# EAGLE board InkTime (EAGLE 9.7.0)
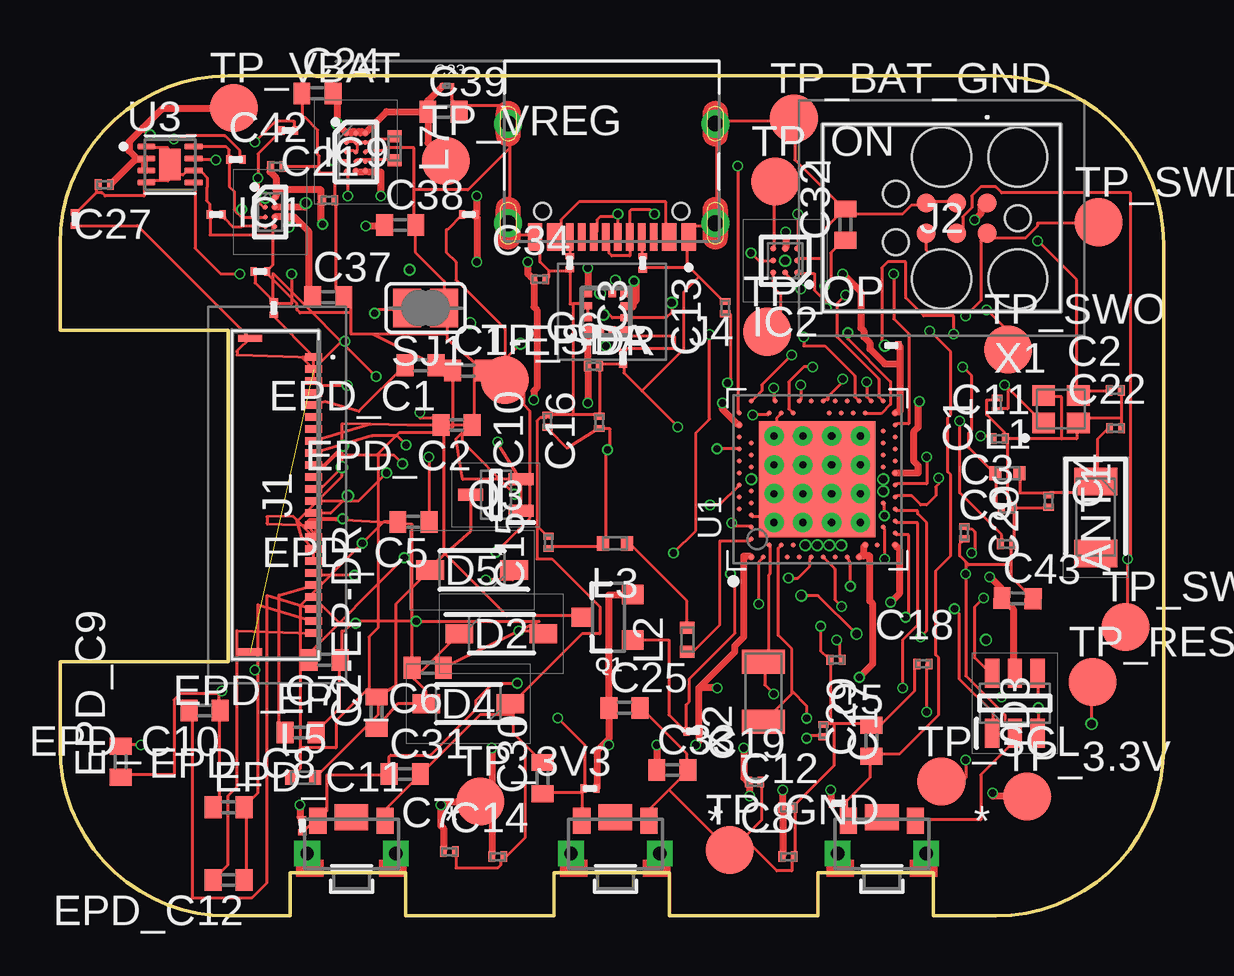
[diagram p2: board, top side]
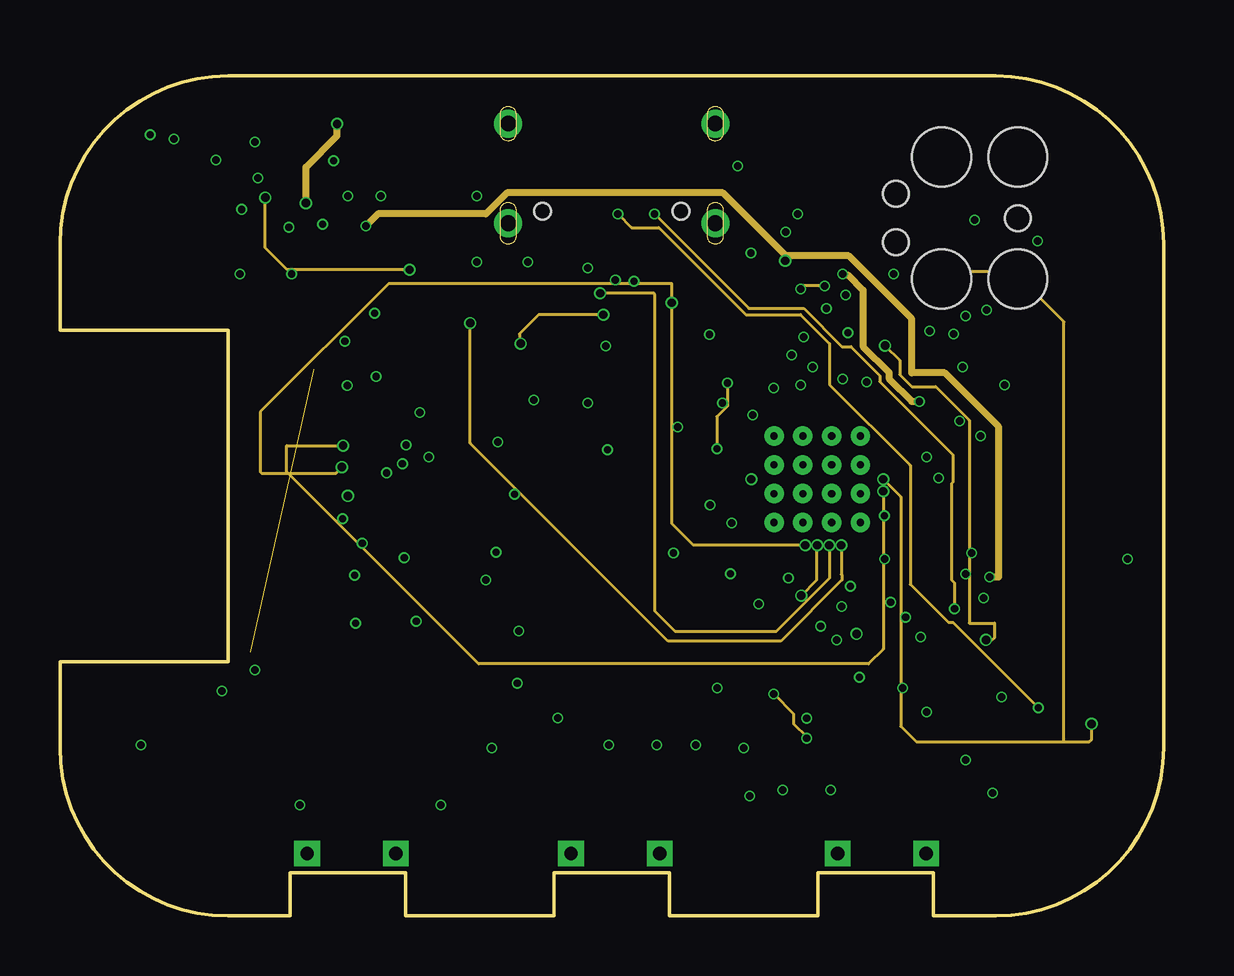
[diagram p3: board, inner layer Route2]
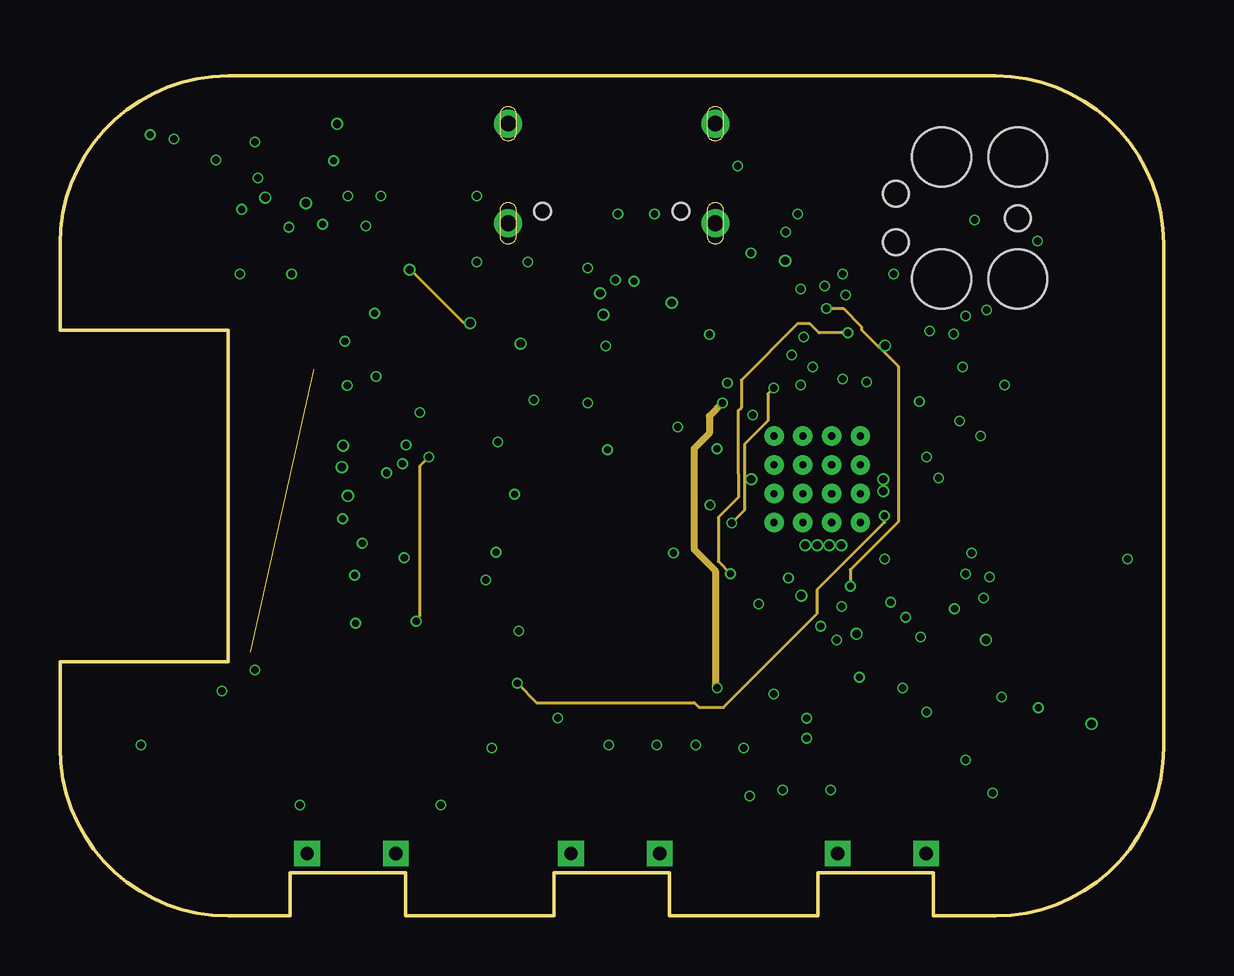
[diagram p4: board, inner layer Route15]
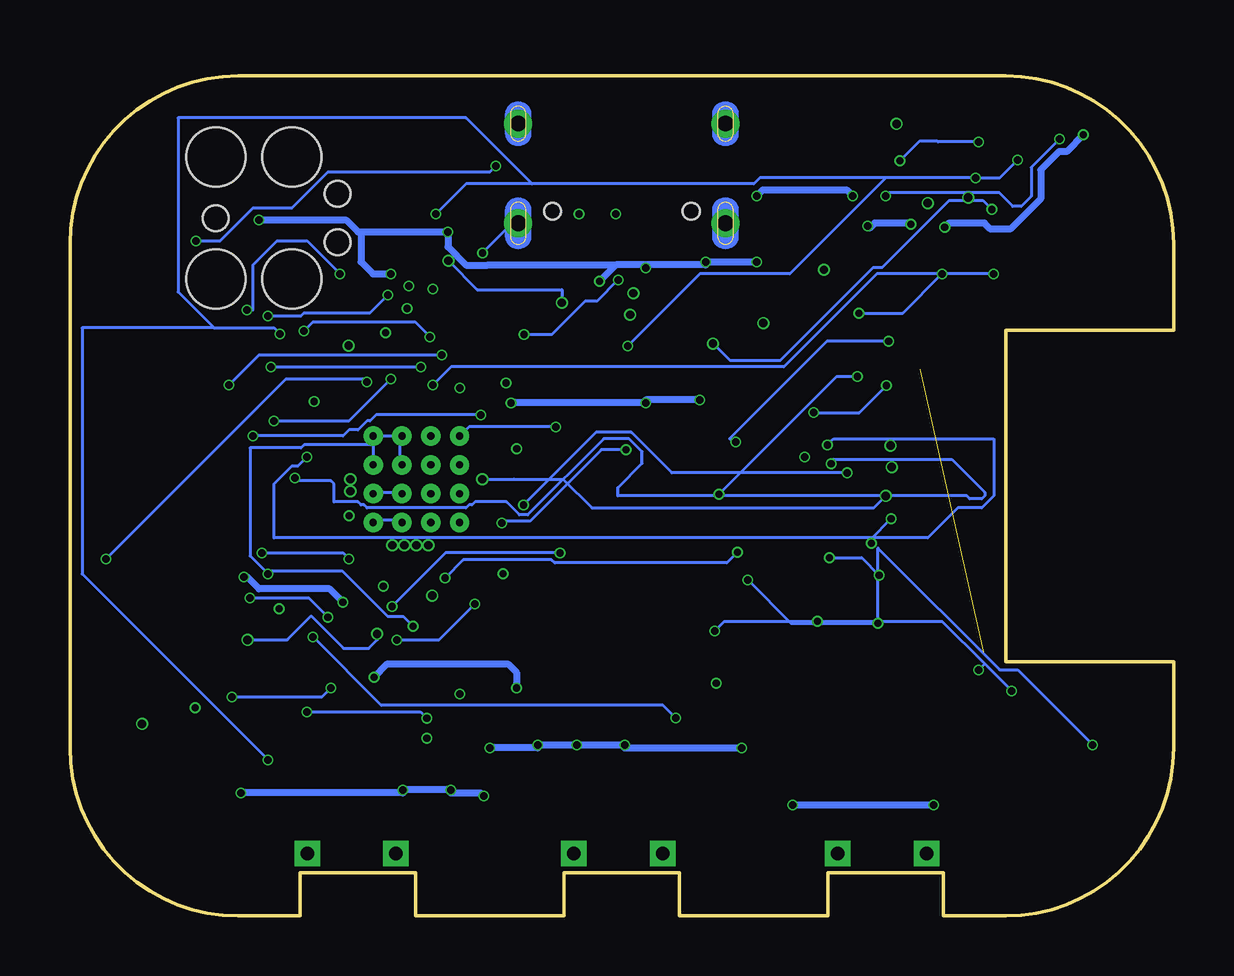
[diagram p5: board, bottom side, seen from below]

Size 46 x 35 mm. Coordinates in mm from the lower left corner, seen from the top.
Outline: 7,35 39,35 arc-90 46,28 46,7 arc-90 39,0 36.4,0 36.4,1.8 31.6,1.8 31.6,0 25.4,0 25.4,1.8 20.6,1.8 20.6,0 14.4,0 14.4,1.8 9.6,1.8 9.6,0 7,0 arc-90 0,7 0,10.6 7,10.6 7,24.4 0,24.4 0,28 arc-90 7,35
Copper layers (1+2*15+16): Top 0.035mm / dielectric 1.6mm / Route2 0.035mm / dielectric 0.15mm / Route15 0.035mm / dielectric 0.2mm / Bottom 0.035mm
Design rules "jlcpcb-2layers.dru *": minimum track width 5mil, minimum drill 0.3mm, track to track 5mil, track to pad 5mil, pad to pad 5mil, via to via 5mil, smd to smd 5mil, copper to edge 0.2mm, drill to drill 6mil, minimum pad ring 10mil, minimum via ring 3mil, stop-mask expansion 4mil, vias tented up to drill 0mil, thermal gap 10mil
Net classes: 1 trasee-de-alimentare: width 0.3 mm

## Footprints (pad centres in the part's own frame; a part is rotated, then mirrored left to right if it is on the bottom)
2450AT18B100E_ANTC3216X140N = smd 1.15 x 1.8: 1 -1.5,0; 2 1.5,0
NORDIC_NRF_3_RESC0201_L = smd 0.28 x 0.43: 1 -0.255,0; 2 0.255,0
ESP32_C6_LIBRARY_1_ESP32_WROVER_EAGLE-LTSPICE_C0402 = smd 0.7 x 0.9: 1 -0.65,0; 2 0.65,0
GRM011R60J152KE01L_2_CAPC0201X13N = smd 0.22 x 0.23: 1 -0.185,0; 2 0.185,0
ESP32_C6_LIBRARY_5_SOD3716X135N = smd 1.15 x 0.8: 1 -1.75,0; 2 1.75,0
ESP32_C6_LIBRARY_3_SOT95P280X145-6N = smd 1.2 x 0.6: 1 -1.25,0.95; 2 -1.25,0; 3 -1.25,-0.95; 4 1.25,-0.95; 5 1.25,0; 6 1.25,0.95
BQ25180YBGR_BGA8C40P2X4_100X155X50 = smd 0.2 x 0.2: A1 -0.2,0.6; A2 0.2,0.6; B1 -0.2,0.2; B2 0.2,0.2; C1 -0.2,-0.2; C2 0.2,-0.2; D1 -0.2,-0.6; D2 0.2,-0.6
DRV2605YZFR_BGA9C50P3X3_144X144X62 = smd 0.25 x 0.25: A1 -0.5,0.5; A2 0,0.5; A3 0.5,0.5; B1 -0.5,0; B2 0,0; B3 0.5,0; C1 -0.5,-0.5; C2 0,-0.5; C3 0.5,-0.5
BMA423_BMA423 = smd 0.3 x 0.35: 1 -0.75,-0.775; 2 -0.25,-0.775; 3 0.25,-0.775; 4 0.75,-0.775; 7 0.75,0.775; 8 0.25,0.775; 9 -0.25,0.775; 10 -0.75,0.775 | smd 0.35 x 0.3: 5 0.775,-0.25; 6 0.775,0.25; 11 -0.775,0.25; 12 -0.775,-0.25
RT6160AWSC_BGA15C40P3X5_140X230X60 = smd 0.216 x 0.216: A1 -0.4,0.8; A2 0,0.8; A3 0.4,0.8; B1 -0.4,0.4; B2 0,0.4; B3 0.4,0.4; C1 -0.4,0; C2 0,0; C3 0.4,0; D1 -0.4,-0.4; D2 0,-0.4; D3 0.4,-0.4; E1 -0.4,-0.8; E2 0,-0.8; E3 0.4,-0.8
503480-2400_5034802400 = smd 0.3 x 0.7: 1 -5.75,1.525; 2 -5.25,1.525; 3 -4.75,1.525; 4 -4.25,1.525; 5 -3.75,1.525; 6 -3.25,1.525; 7 -2.75,1.525; 8 -2.25,1.525; 9 -1.75,1.525; 10 -1.25,1.525; 11 -0.75,1.525; 12 -0.25,1.525; 13 0.25,1.525; 14 0.75,1.525; 15 1.25,1.525; 16 1.75,1.525; 17 2.25,1.525; 18 2.75,1.525; 19 3.25,1.525; 20 3.75,1.525; 21 4.25,1.525; 22 4.75,1.525; 23 5.25,1.525; 24 5.75,1.525 | smd 0.3 x 1: MP1 -6.54,-1.125; MP2 6.54,-1.125
TC2030-IDC_TC2030IDC = smd 0.783 x 0.783: 1 -0.953,-0.635; 2 -0.953,0.635; 3 0.317,-0.635; 4 0.317,0.635; 5 1.588,-0.635; 6 1.588,0.635 | hole 2.451: -2.223,-2.54; -2.223,2.54; 0.952,-2.54; 0.952,2.54 | hole 1.067: -2.223,0; 2.857,-1.016; 2.857,1.016
KH-TYPE-C-16P_KINGHELM_KH-TYPE-C-16P = smd 0.6 x 1.15: A1_B12 -3.2,4.725; A4_B9 -2.4,4.725; A9_B4 2.4,4.725; A12_B1 3.2,4.725 | smd 0.3 x 1.15: A5 -1.25,4.725; A6 -0.25,4.725; A7 0.25,4.725; A8 1.25,4.725; B5 1.75,4.725; B6 0.75,4.725; B7 -0.75,4.725; B8 -1.75,4.725 | drill 0.65 pad 1.05: SH1 -4.32,0; SH2 4.32,0; SH3 -4.32,4.15; SH4 4.32,4.15 | hole 0.7: -2.89,3.65; 2.89,3.65
NORDIC_NRF_2_RESC0402_L = smd 0.5 x 0.6: 1 -0.5,0; 2 0.5,0
ESP32_C6_LIBRARY_4_ESP32_C6_LIBRARY_4_ESP32_C6_LIBRARY_4_ESP32_C6_LIBRARY_4_ESP32_WROVER_SPARKFUN-DISCRETESEMI_SOT23-3 = smd 0.8 x 0.9: 1 -0.95,-1; 2 0.95,-1; 3 0,1.1
ESP32_C6_LIBRARY_6_SOT65P210X110-3N = smd 1.05 x 0.5: 1 -1.05,0.65; 2 -1.05,-0.65; 3 1.05,0
CPF0201D7K68C1_0201 = smd 0.35 x 0.25: 1 0,0.275; 2 0,-0.275
ERA-1AEB3401C_0201 = smd 0.35 x 0.25: 1 0,0.275; 2 0,-0.275
ESP32_C6_LIBRARY_7_JUMPER_SJ = smd 1.168 x 1.6: 1 -0.762,0; 2 0.762,0
2025-10-22_07-23-44_LIBRARY_SW_EVP-AKE31A_PAN = smd 0.711 x 1.092: 1 -1.4,-0.972; 2 1.4,-0.972 | drill 0.559 pad 0.914 square: 3 -1.848,0.381; 4 1.848,0.381 | smd 1.397 x 1.092: 5 0,-1.124
HECTOR_WATCH_1_TP20R = smd 2 x 2: TP 0,0
NORDIC_NRF_4_AQFN50P700X700X85_HS-74N = smd 4.85 x 4.85: P$74 0,0 | drill 0.3 pad 0.6: P$75 -1.8,1.8; P$76 -0.6,1.8; P$77 0.6,1.8; P$78 1.8,1.8; P$79 -1.8,0.6; P$80 -0.6,0.6; P$81 0.6,0.6; P$82 1.8,0.6; P$83 -1.8,-0.6; P$84 -0.6,-0.6; P$85 0.6,-0.6; P$86 1.8,-0.6; P$87 -1.8,-1.8; P$88 -0.6,-1.8; P$89 0.6,-1.8; P$90 1.8,-1.8 | smd 0.2 x 0.2: P$A8 -1.25,3.25; P$A10 -0.75,3.25; P$A12 -0.25,3.25; P$A14 0.25,3.25; P$A16 0.75,3.25; P$A18 1.25,3.25; P$A20 1.75,3.25; P$A22 2.25,3.25; P$A23 2.75,3.25; P$AA24 3.25,-2.25; P$AB2 -2.75,-2.5; P$AC5 -2,-2.75; P$AC9 -1,-2.75; P$AC11 -0.5,-2.75; P$AC13 0,-2.75; P$AC15 0.5,-2.75; P$AC17 1,-2.75; P$AC19 1.5,-2.75; P$AC21 2,-2.75; P$AC24 3.25,-2.75; P$AD2 -2.75,-3.25; P$AD4 -2.25,-3.25; P$AD6 -1.75,-3.25; P$AD8 -1.25,-3.25; P$AD10 -0.75,-3.25; P$AD12 -0.25,-3.25; P$AD14 0.25,-3.25; P$AD16 0.75,-3.25; P$AD18 1.25,-3.25; P$AD20 1.75,-3.25; P$AD22 2.25,-3.25; P$AD23 2.75,-3.25; P$B1 -3.25,2.75; P$B3 -2.5,2.75; P$B5 -2,2.75; P$B7 -1.5,2.75; P$B9 -1,2.75; P$B11 -0.5,2.75; P$B13 0,2.75; P$B15 0.5,2.75; P$B17 1,2.75; P$B19 1.5,2.75; P$B24 3.25,2.75; P$C1 -3.25,2.25; P$D2 -2.75,2; P$D23 2.75,2; P$E24 3.25,1.75; P$F2 -2.75,1.5; P$F23 2.75,1.5; P$G1 -3.25,1.25; P$H2 -2.75,1; P$H23 2.75,1; P$J1 -3.25,0.75; P$J24 3.25,0.75; P$K2 -2.75,0.5; P$L1 -3.25,0.25; P$L24 3.25,0.25; P$M2 -2.75,0; P$N1 -3.25,-0.25; P$N24 3.25,-0.25; P$P2 -2.75,-0.5; P$P23 2.75,-0.5; P$R1 -3.25,-0.75; P$R24 3.25,-0.75; P$T2 -2.75,-1; P$T23 2.75,-1; P$U1 -3.25,-1.25; P$U24 3.25,-1.25; P$V23 2.75,-1.5; P$W1 -3.25,-1.75; P$W24 3.25,-1.75; P$Y2 -2.75,-2; P$Y23 2.75,-2
ESP32_C6_LIBRARY_SON50P200X200X80-9N = smd 0.76 x 0.27: 1 -0.985,0.75; 2 -0.985,0.25; 3 -0.985,-0.25; 4 -0.985,-0.75; 5 0.985,-0.75; 6 0.985,-0.25; 7 0.985,0.25; 8 0.985,0.75 | smd 0.9 x 1.3: 9 0,0
NORDIC_NRF_BT-XTAL_2016_N = smd 0.95 x 0.85: 1 -0.725,-0.575; 2 0.725,-0.575; 3 0.725,0.575; 4 -0.725,0.575
NORDIC_NRF_1_XTAL_3215_N = smd 1 x 1.8: 1 -1.25,0; 2 1.25,0

## Placement (x,y rotation side)
ANT1  2450AT18B100E_2450AT18B100E  [2450AT18B100E_ANTC3216X140N]  43.17,16.61 270 top
C1  12pF  [NORDIC_NRF_3_RESC0201_L]  39.06,21.32 90 top
C1-EP-DR  10uF  [ESP32_C6_LIBRARY_1_ESP32_WROVER_EAGLE-LTSPICE_C0402]  17.01,22.72 0 top
C2  12pF  [NORDIC_NRF_3_RESC0201_L]  43.98,21.9 0 top
C2-EP-DR  4.7uF/25V  [ESP32_C6_LIBRARY_1_ESP32_WROVER_EAGLE-LTSPICE_C0402]  13.2,8.47 90 top
C3  1pF  [NORDIC_NRF_3_RESC0201_L]  39.5,16.97 0 top
C4  1pF  [NORDIC_NRF_3_RESC0201_L]  41.21,17.28 270 top
C5  100nF  [NORDIC_NRF_3_RESC0201_L]  32.35,10.68 180 top
C6  4.7μF  [NORDIC_NRF_3_RESC0201_L]  22.24,22.91 0 top
C7  100nF  [NORDIC_NRF_3_RESC0201_L]  16.23,2.68 0 top
C8  100nF  [NORDIC_NRF_3_RESC0201_L]  30.35,2.47 0 top
C9  820pF  [NORDIC_NRF_3_RESC0201_L]  39.45,15.5 0 top
C10  N.C.  [NORDIC_NRF_3_RESC0201_L]  20.32,20.62 90 top
C11  100pF  [NORDIC_NRF_3_RESC0201_L]  39.15,19.89 0 top
C12  100nF  [NORDIC_NRF_3_RESC0201_L]  30.35,4.52 0 top
C13  N.C.  [NORDIC_NRF_3_RESC0201_L]  27.73,25.34 90 top
C14  4.7μF  [NORDIC_NRF_3_RESC0201_L]  18.25,2.47 0 top
C15  1.0μF  [NORDIC_NRF_3_RESC0201_L]  20.37,15.57 90 top
C16  47nF  [NORDIC_NRF_3_RESC0201_L]  22.48,20.57 90 top
C17  12pF  [NORDIC_NRF_3_RESC0201_L]  31.82,7.72 270 top
C18  12pF  [NORDIC_NRF_3_RESC0201_L]  35.97,10.5 0 top
C19  100nF  [NORDIC_NRF_3_RESC0201_L]  28.95,5.58 0 top
C20  4.7μF  [NORDIC_NRF_3_RESC0201_L]  37.7,15.97 270 top
C21  4.7μF  [NORDIC_NRF_3_RESC0201_L]  11.2,29.82 0 top
C22  N.C.  [NORDIC_NRF_3_RESC0201_L]  44,20.32 0 top
C23  0.1uF  [GRM011R60J152KE01L_2_CAPC0201X13N]  16.13,34.58 0 top
C24  10uF  [ESP32_C6_LIBRARY_1_ESP32_WROVER_EAGLE-LTSPICE_C0402]  10.73,34.27 0 top
C25  22uF  [ESP32_C6_LIBRARY_1_ESP32_WROVER_EAGLE-LTSPICE_C0402]  23.53,8.67 0 top
C27  0.1uF  [NORDIC_NRF_3_RESC0201_L]  1.85,30.47 180 top
C29  [ESP32_C6_LIBRARY_1_ESP32_WROVER_EAGLE-LTSPICE_C0402]  33.82,7.3 90 top
C30  [ESP32_C6_LIBRARY_1_ESP32_WROVER_EAGLE-LTSPICE_C0402]  20.11,5.74 90 top
C31  [ESP32_C6_LIBRARY_1_ESP32_WROVER_EAGLE-LTSPICE_C0402]  14.37,5.91 0 top
C32  1uF  [ESP32_C6_LIBRARY_1_ESP32_WROVER_EAGLE-LTSPICE_C0402]  32.74,28.81 90 top
C33  22uF  [ESP32_C6_LIBRARY_1_ESP32_WROVER_EAGLE-LTSPICE_C0402]  25.53,6.08 0 top
C34  0.1uF  [NORDIC_NRF_3_RESC0201_L]  20,26.53 0 top
C37  1uF  [ESP32_C6_LIBRARY_1_ESP32_WROVER_EAGLE-LTSPICE_C0402]  11.19,25.78 0 top
C38  1uF  [ESP32_C6_LIBRARY_1_ESP32_WROVER_EAGLE-LTSPICE_C0402]  14.19,28.79 0 top
C39  10uF  [ESP32_C6_LIBRARY_1_ESP32_WROVER_EAGLE-LTSPICE_C0402]  15.99,33.51 0 top
C42  [NORDIC_NRF_3_RESC0201_L]  9.03,31.23 0 top
C43  [ESP32_C6_LIBRARY_1_ESP32_WROVER_EAGLE-LTSPICE_C0402]  39.91,13.23 358.7 top
D2  ESP32_C6_LIBRARY_5_MBR0530  [ESP32_C6_LIBRARY_5_SOD3716X135N]  18.4,11.76 0 top
D3  ESP32_C6_LIBRARY_3_USBLC6-2SC6Y  [ESP32_C6_LIBRARY_3_SOT95P280X145-6N]  39.8,8.86 90 top
D4  ESP32_C6_LIBRARY_5_MBR0530  [ESP32_C6_LIBRARY_5_SOD3716X135N]  17.03,8.84 180 top
D5  ESP32_C6_LIBRARY_5_MBR0530  [ESP32_C6_LIBRARY_5_SOD3716X135N]  17.18,14.41 180 top
EPD_C1  1uF/50V  [ESP32_C6_LIBRARY_1_ESP32_WROVER_EAGLE-LTSPICE_C0402]  15.03,22.95 180 top
EPD_C2  1uF/50V  [ESP32_C6_LIBRARY_1_ESP32_WROVER_EAGLE-LTSPICE_C0402]  16.53,20.45 180 top
EPD_C5  0.1uF/50V  [ESP32_C6_LIBRARY_1_ESP32_WROVER_EAGLE-LTSPICE_C0402]  14.73,16.42 180 top
EPD_C6  1uF/50V  [ESP32_C6_LIBRARY_1_ESP32_WROVER_EAGLE-LTSPICE_C0402]  15.33,10.34 180 top
EPD_C7  1uF/50V  [ESP32_C6_LIBRARY_1_ESP32_WROVER_EAGLE-LTSPICE_C0402]  11.03,10.67 180 top
EPD_C8  1uF/50V  [ESP32_C6_LIBRARY_1_ESP32_WROVER_EAGLE-LTSPICE_C0402]  10.03,7.64 180 top
EPD_C9  1uF/50V  [ESP32_C6_LIBRARY_1_ESP32_WROVER_EAGLE-LTSPICE_C0402]  2.53,6.43 90 top
EPD_C10  1uF/50V  [ESP32_C6_LIBRARY_1_ESP32_WROVER_EAGLE-LTSPICE_C0402]  6.03,8.56 180 top
EPD_C11  1uF/50V  [ESP32_C6_LIBRARY_1_ESP32_WROVER_EAGLE-LTSPICE_C0402]  7.03,4.53 0 top
EPD_C12  1uF/50V  [ESP32_C6_LIBRARY_1_ESP32_WROVER_EAGLE-LTSPICE_C0402]  7.03,1.5 180 top
IC1  BQ25180YBGR_BQ25180YBGR  [BQ25180YBGR_BGA8C40P2X4_100X155X50]  8.76,29.33 0 top
IC2  DRV2605YZFR_DRV2605YZFR  [DRV2605YZFR_BGA9C50P3X3_144X144X62]  30.23,27.3 180 top
IC3  BMA423_BMA423  [BMA423_BMA423]  22.77,25.17 90 top
IC9  RT6160AWSC_RT6160AWSC  [RT6160AWSC_BGA15C40P3X5_140X230X60]  12.33,31.83 0 top
J1  503480-2400_503480-2400  [503480-2400_5034802400]  9.05,17.54 270 top
J2  TC2030-IDC_TC2030-IDC  [TC2030-IDC_TC2030IDC]  37.7,29.08 180 top
J4  KH-TYPE-C-16P_KH-TYPE-C-16P  [KH-TYPE-C-16P_KINGHELM_KH-TYPE-C-16P]  23,33.01 180 top
L1  [NORDIC_NRF_2_RESC0402_L]  39.49,18.45 0 top
L2  10uH  [NORDIC_NRF_2_RESC0402_L]  26.15,11.5 90 top
L3  15nH  [NORDIC_NRF_2_RESC0402_L]  23.14,15.52 180 top
L5  68uH  [NORDIC_NRF_2_RESC0402_L]  10.14,5.77 0 top
L7  [NORDIC_NRF_2_RESC0402_L]  13.95,31.99 270 top
Q1  20V/4.2A/52mΩ/1.4W  [ESP32_C6_LIBRARY_4_ESP32_C6_LIBRARY_4_ESP32_C6_LIBRARY_4_ESP32_C6_LIBRARY_4_ESP32_WROVER_SPARKFUN-DISCRETESEMI_SOT23-3]  22.87,12.45 90 top
Q3  ESP32_C6_LIBRARY_6_SI1308EDL-T1-GE3  [ESP32_C6_LIBRARY_6_SOT65P210X110-3N]  18.17,17.54 180 top
R1_EP_DR  0.47  [CPF0201D7K68C1_0201]  8.91,25.33 0 top
R1_USB  5K1  [CPF0201D7K68C1_0201]  24.3,27.21 180 top
R2  0  [CPF0201D7K68C1_0201]  7.33,31.52 270 top
R2_EP_DR  10K  [CPF0201D7K68C1_0201]  0.63,29.04 0 top
R2_USB  5K1  [CPF0201D7K68C1_0201]  21.25,27.22 0 top
R3  0  [ERA-1AEB3401C_0201]  23.47,23.24 0 top
R4  0  [CPF0201D7K68C1_0201]  9.52,32.72 270 top
R5  10K  [CPF0201D7K68C1_0201]  22.09,5.31 90 top
R7  10K  [CPF0201D7K68C1_0201]  32.44,4.69 270 top
R8  10K  [CPF0201D7K68C1_0201]  10.1,3.77 181.2 top
R9  10K  [CPF0201D7K68C1_0201]  6.51,29.22 90 top
R17  3K3  [CPF0201D7K68C1_0201]  34.66,23.77 270 top
R18  3K3  [CPF0201D7K68C1_0201]  17.04,29.22 270 top
R_PWR_EPD  10K  [CPF0201D7K68C1_0201]  26.39,7.69 90 top
R_TYPE_SEL  2.2  [CPF0201D7K68C1_0201]  8.35,26.85 270 top
SJ1  [ESP32_C6_LIBRARY_7_JUMPER_SJ]  15.24,25.33 180 top
SW_DN  2025-10-22_07-23-44_LIBRARY_EVP-AKE31ASW_EVP-AKE31A_PAN  [2025-10-22_07-23-44_LIBRARY_SW_EVP-AKE31A_PAN]  34.26,2.99 180 top
SW_ENT  2025-10-22_07-23-44_LIBRARY_EVP-AKE31ASW_EVP-AKE31A_PAN  [2025-10-22_07-23-44_LIBRARY_SW_EVP-AKE31A_PAN]  12.15,2.99 180 top
SW_UP  2025-10-22_07-23-44_LIBRARY_EVP-AKE31ASW_EVP-AKE31A_PAN  [2025-10-22_07-23-44_LIBRARY_SW_EVP-AKE31A_PAN]  23.15,2.99 180 top
TP_3.3V  HECTOR_WATCH_1_TPTP20R  [HECTOR_WATCH_1_TP20R]  40.32,4.98 0 top
TP_3V3  HECTOR_WATCH_1_TPTP20R  [HECTOR_WATCH_1_TP20R]  17.53,4.78 0 top
TP_BAT_GND  HECTOR_WATCH_1_TPTP20R  [HECTOR_WATCH_1_TP20R]  30.59,33.23 0 top
TP_GND  HECTOR_WATCH_1_TPTP20R  [HECTOR_WATCH_1_TP20R]  27.91,2.75 0 top
TP_ON  HECTOR_WATCH_1_TPTP20R  [HECTOR_WATCH_1_TP20R]  29.81,30.6 0 top
TP_OP  HECTOR_WATCH_1_TPTP20R  [HECTOR_WATCH_1_TP20R]  29.47,24.34 0 top
TP_RESET  HECTOR_WATCH_1_TPTP20R  [HECTOR_WATCH_1_TP20R]  43.05,9.75 0 top
TP_SCL  HECTOR_WATCH_1_TPTP20R  [HECTOR_WATCH_1_TP20R]  36.74,5.59 0 top
TP_SDA  HECTOR_WATCH_1_TPTP20R  [HECTOR_WATCH_1_TP20R]  18.54,22.34 0 top
TP_SWDCLK  HECTOR_WATCH_1_TPTP20R  [HECTOR_WATCH_1_TP20R]  44.42,12.05 0 top
TP_SWDIO  HECTOR_WATCH_1_TPTP20R  [HECTOR_WATCH_1_TP20R]  43.29,28.9 0 top
TP_SWO  HECTOR_WATCH_1_TPTP20R  [HECTOR_WATCH_1_TP20R]  39.51,23.61 0 top
TP_VBAT  HECTOR_WATCH_1_TPTP20R  [HECTOR_WATCH_1_TP20R]  7.24,33.66 0 top
TP_VREG  HECTOR_WATCH_1_TPTP20R  [HECTOR_WATCH_1_TP20R]  16.08,31.46 0 top
U1  NORDIC_NRF_4_NRF52840_QF  [NORDIC_NRF_4_AQFN50P700X700X85_HS-74N]  31.56,18.2 90 top
U3  ESP32_C6_LIBRARY_MAX17048G+T10  [ESP32_C6_LIBRARY_SON50P200X200X80-9N]  4.59,31.31 0 top
X1  32MHz  [NORDIC_NRF_BT-XTAL_2016_N]  41.72,21.11 0 top
X2  [NORDIC_NRF_1_XTAL_3215_N]  29.33,9.33 90 top

## Tracks (layer width: path | path; a pad name or v marks a point on that pad's centre or on a via)
3V3  (via drill 0.3)
  Top 0.3: v22,21.38 22,22.88 C6.1 22,23 22,24.38 IC3.10 | IC9.E2 12.38,31 12.62,31 IC9.E3 12.88,31 13.38,31 v13.38,30 | v17.38,27.25 17.38,29.12 R18.1 17.38,29.25 v17.38,30 | v19.5,27.25 19.5,26.75 19.62,26.62 C34.1 19.75,26.5 19.75,25.38 19.88,25.25 19.88,22 19.75,21.88 v19.75,21.5 | v23.93,26.45 24,26.38 24,25.62 23.88,25.5 23.88,25.38 23.62,25.38 IC3.3 | v22,27 22,26 IC3.7 | 35,23 35,23.75 R17.1 | 35,23 35,21 34.88,21 U1.P$AD23 | v30.25,28.5 30.25,27.88 IC2.C2 | v38.12,29 38.38,29.25 38.38,29.62 38.5,29.75 38.62,29.75 J2.1 | 35,23 34.38,23 33.75,23.62 33.75,23.88 33.5,24.12 33.5,24.38 33.38,24.5 33.38,26 v32.62,26.75 | v32.12,5.25 32.12,4.75 R7.2 | v30.12,5.25 30.12,4.62 C12.1 30.12,4.38 30.12,2.5 C8.1 | v28.75,5 28.75,5.5 C19.1 28.62,5.62 28.5,5.75 v28.5,7 | v38.88,5.12 38.88,5 40.25,5 TP_3.3V.TP | C14.1 18,2.5 18,4.75 17.62,4.75 TP_3V3.TP | v10,4.62 10,4.12 R8.2 | C7.1 16,2.75 16,3.62 15.88,3.75 v15.88,4.62 16,4.62 16,4.75 17.38,4.75 TP_3V3.TP | 22.81,7.31 22.88,7.38 22.88,8.62 C25.1 22.88,8.75 22.88,13.38 23.75,13.38 Q1.2 | 22.81,7.31 22.38,6.88 22.38,5.38 R5.2 | 33.5,15 33.38,15 U1.P$W1 | 33.5,15 33.5,15.38 U1.P$Y2 | v24.88,7.12 24.88,6.12 C33.1 | v26.5,7.12 26.62,7.25 26.62,7.62 R_PWR_EPD.2 26.62,7.75 26.62,9.5 | 26.62,9.5 28.12,11 28.12,11.25 28.5,11.62 28.5,15 28.75,15 U1.P$B1 | v33.33,9.95 33.88,10.5 33.88,13 33.75,13.12 33.75,15 33.5,15 | v22.88,7.12 22.88,7.25 22.81,7.31 | v18,7 18,4.88 TP_3V3.TP | v35.83,21.44 35.76,21.37 35.76,20.36 35.57,20.17 35.57,18.96 35.76,18.77 35.76,18.45 34.87,18.45 U1.P$AD14 | U1.P$A22 28.26,20.5 28.23,20.5 27.62,21.11 v27.62,21.38
  Top 0.3: v27.39,9.5 26.62,9.5
  Route2 0.3: v35.83,21.44 35.51,21.44 34.56,22.39 34.56,22.64 33.48,23.72 33.48,26.07 32.84,26.71 32.65,26.71 v32.62,26.75
  Route15 0.3: v27.62,21.38 27.06,20.82 27.06,20.1 26.43,19.47 26.43,15.28 27.32,14.39 27.32,9.58 v27.39,9.5
  Bottom 0.3: v17.38,27.25 v19.5,27.25 19.5,27.12 22,27.12 | 23.25,27.12 v23.93,26.45 | 22,27.12 23.25,27.12 | v22,27 22,27.12 | v13.38,30 13.62,30.25 17.12,30.25 v17.38,30 | 33.88,28.5 34,28.5 34.5,29 v38.12,29 | 33.88,28.5 v30.25,28.5 30.25,27.88 29.5,27.12 28.59,27.12 23.25,27.12 | v32.62,26.75 33.38,26.75 33.88,27.25 33.88,28.5 | v19.75,21.5 22,21.5 v22,21.38 v27.62,21.38 | v28.75,5 28.88,5.12 30.12,5.12 v30.12,5.25 v32.12,5.25 32.12,5.12 v38.88,5.12 | v15.88,4.62 v10,4.62 | v33.33,9.95 32.77,10.5 27.75,10.5 27.39,10.14 v27.39,9.5 | v18,7 22.88,7 v22.88,7.12 v24.88,7.12 v26.5,7.12 26.5,7 v28.5,7
ALERT  (via drill 0.3)
  Top 0.127: v30.88,22.12 30.88,21.5 U1.P$J24 | v7.5,26.75 6.7,26.75 5.62,27.82 5.62,30.5 U3.5
  Bottom 0.127: v30.88,22.12 30.12,22.88 16.25,22.88 12.38,26.75 v7.5,26.75
D+  (via drill 0.3)
  Top 0.127: v35.12,9.5 35.12,11.5 35.75,12.12 35.75,16.38 34.88,16.38 U1.P$AD6 | v39.25,9.12 40.75,9.12 D3.4
  Bottom 0.127: v35.12,9.5 35.5,9.12 v39.25,9.12
D-  (via drill 0.3)
  Top 0.127: v35.25,12.45 35.38,12.57 35.38,15.88 34.88,15.88 U1.P$AD4 | v38.5,13.25 38.12,12.88 38.12,10.75 38.75,10.12 D3.6
  Bottom 0.127: v35.25,12.45 36.05,13.25 v38.5,13.25
DN  (via drill 0.3)
  Top 0.127: J4.A7 22.75,28.25 22.88,28.12 22.88,27.62 23,27.5 23.75,27.5 J4.B7 23.76,28.3 23.76,29.37 23.83,29.44 24.59,29.44 v24.78,29.25 | v37.29,12.8 37.48,12.61 37.48,9.88 38.88,8.48 38.88,7.66 D3.1
  Route2 0.127: v37.29,12.8 37.29,13.88 37.16,14.01 37.16,18.01 37.22,18.07 37.22,19.21 34.18,22.26 34.18,22.52 32.97,23.72 32.59,23.72 31,25.31 28.71,25.31 v24.78,29.25
DP  (via drill 0.3)
  Top 0.127: 23.25,29.12 22.5,29.12 22.38,29 22.38,28.5 22.25,28.38 J4.B6 | J4.A6 23.25,29.12 | v40.78,8.67 40.78,7.66 D3.3 | v23.25,29.25 23.25,29.18 23.25,29.12
  Route2 0.127: v40.78,8.67 37.22,12.23 37.03,12.23 35.45,13.82 35.45,18.77 32.08,22.14 32.08,23.85 30.87,25.06 28.59,25.06 24.97,28.68 23.83,28.68 v23.25,29.25
EPD_3V3  (via drill 0.3)
  Top 0.127: J1.15 8.62,16.35 8.62,16.38 8.62,16.62 8.62,16.64 9.71,16.65 J1.16 10.8,16.55 v11.78,16.55 | 10,7 10,12.93 v12.6,15.53 13.49,16.42 EPD_C5.2 | 10,7 10,6.12 9.75,5.88 L5.1 | 16,20.12 16,15.12 18.62,12.5 21.75,12.5 Q1.3 | C1-EP-DR.1 16.36,20.34 16,20.12 | 10,7 11.5,7 11.5,8.12 12.88,9.5 12.88,11.62 13.25,12 13.25,19.25 14.12,20.12 16,20.12
  Bottom 0.127: v12.6,15.53 12.6,15.72 v11.78,16.55
EPD_BUSY  (via drill 0.3)
  Top 0.127: v36.12,19.12 36.12,18 34.88,18 U1.P$AD12 | v14.43,19.62 14.05,20 13.02,20 J1.9
  Bottom 0.127: v36.12,19.12 36.5,18.75 36.75,18.75 37.5,18 37.5,15.75 10.25,15.75 9,17 8,17 7.5,17.5 7.5,19.88 14.18,19.88 v14.43,19.62
EPD_CS  (via drill 0.35)
  Top 0.127: v11.75,18.7 10.84,17.79 J1.12
  Route2 0.127: U1.P$K2 26.4,15.45 25.5,16.35 25.5,26.35 13.7,26.35 8.35,21 8.35,18.5 8.4,18.45 11.5,18.45 v11.75,18.7
  other vias: 31.06,15.45
EPD_DC  (via drill 0.3)
  Top 0.127: v36.62,18.25 36.62,18 36.5,17.88 36.5,17.5 36.12,17.12 35.88,17.12 35.5,17.5 34.88,17.5 U1.P$AD10 | v14.28,18.84 13.93,19.19 11.48,19.19 J1.11
  Bottom 0.127: v36.62,18.25 36.5,18.12 35.12,18.12 35,18 35,17.25 34,17.25 33.88,17.12 33.75,17.12 33.62,17 29.5,17 29.38,17.12 29.25,17.12 29.12,17.25 27.81,17.25 27.27,16.71 26.93,16.71 23.74,19.89 22.7,19.89 22.16,19.35 22.16,18.85 23.16,17.85 23.16,17.5 8.62,17.5 8.5,17.38 8,17.38 7.88,17.5 7.88,17.65 9.25,19.02 14.28,19.02 v14.28,18.84
EPD_RST  (via drill 0.35)
  Top 0.127: v11.8,19.6 10.99,18.79 J1.10
  Route2 0.127: U1.P$AC11 34.31,11.11 33.7,10.5 17.45,10.5 9.45,18.5 9.45,19.6 v11.8,19.6
  other vias: 34.31,17.7
GDR  (via drill 0.3)  (1 unrouted)
  Top 0.127: R2_EP_DR.2 3.24,28.77 J1.MP1 7.39,23.54 7.38,23.5 7.38,23.38 7.39,23.39 J1.1 10.12,23.29 10.12,23.25 10.12,23.24 J1.2 11.74,23.95 v11.88,23.95 | Q3.1 19.22,18.14 18.22,19.73 v18.25,19.75
  Bottom 0.127: v11.88,23.95 14.45,23.95 18.51,19.89 18.5,19.88 18.38,19.88 v18.25,19.75
GND  (via drill 0.3)
  Top 0.127: 1.5,30.12 0.75,29.38 R2_EP_DR.1 | 1.5,30.12 1.5,30.38 C27.2 | 4.5,30.88 4.5,31.25 U3.9 | 4.5,30.88 4.5,30.62 3.62,30.62 U3.4 3.5,30.5 3.5,30 1.88,30 1.75,30.12 1.5,30.12 | U3.1 3.62,32 4.5,32 4.5,31.38 U3.9 | 8.88,28.38 8.88,27.12 8.62,26.88 R_TYPE_SEL.1 8.62,26.75 9.88,25.5 9.88,25.25 10,25.12 12.12,25.12 | 8.88,28.38 8.88,28.75 IC1.D2 | 8.88,28.38 6.25,28.38 6.25,29.12 R9.1 6.23,29.68 6.11,29.81 6.11,30.33 6.14,30.37 6.14,30.75 5.9,31 5.62,31 U3.6 5.5,31 5.25,31 5.12,30.88 4.5,30.88 | 4.5,30.88 U3.9 | J1.17 10.07,15.8 9.88,16.45 11.75,18.32 11.75,20.5 12.95,20.48 | 12.95,20.48 14.49,20.45 EPD_C2.1 17.25,20.5 17.25,23 17.28,23.04 | 12.95,20.48 J1.8 | 14.75,30.25 14.75,28.88 C38.2 14.81,28.74 14.81,27.66 16.02,26.45 16.02,25.37 SJ1.1 16.12,25.25 16.12,24.25 | 14.75,30.25 14.75,32 13.62,32 13.5,31.88 12.75,31.88 IC9.C3 | 16.12,24.25 16.12,24.02 17.28,23.04 | 17.28,23.04 C1-EP-DR.2 | 12.12,25.12 12.12,24.25 13.03,24.25 | 12.12,25.12 12.12,25.5 11.88,25.75 C37.2 | 13.03,24.25 EPD_C1.1 | 11.5,26.12 11.75,25.88 C37.2 | 13.03,24.25 16.12,24.25 | SW_DN.1 35.75,4 38.38,4 38.38,5.88 39.75,7.25 39.75,7.5 D3.2 39.75,7.62 39.38,8 39.38,8.38 37.75,10 v37.75,14.25 37.75,14.75 | 44.25,20.75 44.25,20.38 C22.2 | 44.25,20.75 44.25,21.88 C2.2 | 41.75,19.88 42.38,19.88 42.38,20.5 X1.2 42.5,20.62 42.5,20.75 44.25,20.75 | 41.75,19.88 39.5,19.88 | C1.2 39,21.5 38.62,21.5 38.62,20.88 39.38,20.12 39.38,20 C11.2 39.5,19.88 | 41.75,19.88 41.75,21.62 41,21.62 X1.4 | C3.2 39.75,16.88 39.75,15.5 C9.2 39.62,15.38 39.62,14.62 | 37.75,14.75 37.88,14.62 39.62,14.62 | 37.75,14.75 37.5,15 37.5,15.5 37.62,15.62 C20.2
  Top 0.127: C4.2 41.12,17 39.88,17 C3.2 | 39.62,14.62 39.62,14.12 40.5,13.25 C43.2 | 39.5,19.88 39.5,17.38 39.75,17.12 39.75,17 C3.2 | J2.3 37.38,29.75 36.12,29.75 J2.5 36,29.62 35.5,29.62 35.12,29.25 32.75,29.25 32.75,29.38 C32.2 | IC2.B1 30.75,27.38 31.75,27.38 31.75,28.5 32.62,29.38 C32.2 | IC2.B3 29.12,27.3 v28.8,27.62 | 26.12,27.12 26.12,28.25 J4.A1_B12 26.25,28.38 26.25,28.75 27.25,28.75 J4.SH3 27.38,28.88 27.38,33 J4.SH1 27.38,33.12 30.5,33.12 TP_BAT_GND.TP 30.62,33.12 30.62,31.5 32.62,29.5 C32.2 | 26.12,27.12 26.12,27 24.38,27 R1_USB.1 | 26.12,27.12 26.62,26.62 | 26.62,26.62 27.62,25.62 C13.2 | 28.5,3.25 28,2.75 TP_GND.TP | 28.5,3.25 29.25,4 29.25,5.5 C19.2 | 25.38,5.25 24.62,4.5 24.62,4 SW_UP.1 | 25.38,5.25 26.12,6 C33.2 26.12,6.12 26.12,6.75 24.25,8.62 C25.2 | 25.38,5.25 27.88,2.75 TP_GND.TP | 32.25,8 33.75,8 C29.2 33.88,8 34.25,8 35.62,9.38 35.62,10.5 C18.1 | 32.25,8 32.12,8 | 32.12,8 31.88,8 C17.1 | 32.12,8 32.12,10.62 C5.2 32,10.75 31.71,11.04 v31.71,12.07 | 32.25,8 32.25,6.25 30.62,4.62 C12.2 30.62,4.5 30.62,2.5 C8.2 30.5,2.38 30.5,1.88 29.88,1.88 28.5,3.25 | 28.5,3.25 TP_GND.TP | SW_ENT.1 13.62,4 13.62,4.5 15,5.88 C31.2 15.12,6 17.5,8.38 18.88,8.38 | C7.2 16.5,2.62 16.5,2 18.25,2 18.38,2.12 18.38,2.25 18.5,2.38 C14.2 18.62,2.5 19.38,3.25 19.38,7.12 | 19.38,7.12 18.88,7.62 18.88,8.38 | 19.38,7.12 20,6.5 C30.2 | 18.88,8.38 18.88,8.75 D4.1 18.88,8.88 21.75,11.75 22.5,11.75 22.5,12.88 20.5,14.88 19.88,14.88 19.88,16.25 | 29.75,16.5 29.75,16.62 28.88,16.62 U1.P$B7 | 29.88,20 29.88,20.75 30,20.88 U1.P$F23 | 29.75,16.5 U1.P$75 | 29.75,16.5 U1.P$74 | U1.P$76 29.88,17.5 30.25,17.12 30.25,17 U1.P$74
  Top 0.127: U1.P$77 29.88,18.88 30.38,19.38 U1.P$74 | 29.88,20 U1.P$78 | 29.88,20 U1.P$74 | U1.P$79 30.88,16.5 30.38,17 U1.P$74 | U1.P$80 31,17.62 U1.P$74 | U1.P$81 31,18.88 U1.P$74 | U1.P$82 30.88,19.88 30.5,19.5 30.5,19.38 U1.P$74 | U1.P$74 31.62,18.12 32.12,17.62 U1.P$84 32.25,17.5 32.25,16.5 U1.P$83 | U1.P$85 32.12,18.75 31.62,18.25 U1.P$74 | 21.38,20.88 22.38,20.88 C16.2 22.5,20.88 22.5,22.88 C6.2 22.5,23 23.38,23 R3.2 23.5,22.88 23.5,22.62 24.25,21.88 | 21.38,20.88 20.38,20.88 C10.2 20.25,20.75 20,20.75 19.88,20.62 19.88,16.25 | 19.88,16.25 20.25,15.88 C15.2 | 16.71,33.63 16.79,33.75 18.62,33.75 18.62,33.12 J4.SH2 18.75,33 18.75,32 | 16.71,33.63 C39.2 | IC3.9 22,25 22,25.38 IC3.8 21.88,25.5 21.38,25.5 | 20.38,26.88 21.25,26.88 | 20.38,26.88 20.38,26.62 C34.2 | 21.38,25.5 21.25,25.5 21.25,26.88 | 21.25,26.88 R2_USB.2 | 20.38,26.88 20,27.25 20,28.12 19.88,28.25 J4.A12_B1 19.75,28.38 18.75,28.38 18.75,28.75 J4.SH4 18.75,28.88 18.75,32 | 21.38,25.5 21.38,20.88 | 24.25,21.88 v25.75,20.38 | 26.62,26.62 26,26 26,23.62 24.25,21.88 | 14.75,30.25 17,30.25 18.75,32 | C23.2 16.31,34.03 16.71,33.63 | 10.81,31.21 9.28,31.21 9.28,31.22 C42.2 | 10.81,31.21 10.81,30.96 11.38,30.96 11.44,30.9 11.44,29.86 C21.2 11.5,29.75 11.5,26.12 | 10.81,31.21 10.81,31.66 10.74,31.72 10.74,32.74 10.24,33.25 10.17,33.25 10.11,33.31 10.11,34.26 C24.1 | 11.5,26.12 C37.2
  Bottom 0.127: v28.8,27.62 27.68,28.75 27.38,28.75 J4.SH3 | 33.38,19.62 33.38,19.88 U1.P$90 | 33.38,19.62 33.38,18.88 U1.P$89 | U1.P$90 33.25,20 32.25,20 U1.P$86 32.25,19.88 32.25,18.88 U1.P$85 | U1.P$83 32.25,16.5 33.25,16.5 U1.P$87 | U1.P$88 33.25,17.62 32.25,17.62 U1.P$84 | v25.75,20.38 29.38,20.38 U1.P$78 | 37.75,14.38 37.88,14.38 38.5,15 38.5,19.5 36.38,19.5 36.25,19.62 33.38,19.62 | 33.38,19.62 U1.P$90 | 37.75,14.38 v37.75,14.25 | v31.71,12.07 32.11,12.48 32.75,12.48 34.65,14.38 37.75,14.38
HAPTIC_EN  (via drill 0.3)
  Top 0.127: v32.94,13.73 32.94,14.72 U1.P$U1 | v31.95,25.31 31.95,25.56 31.45,26.07 31.45,26.77 30.75,26.77 IC2.A1
  Route15 0.127: v31.95,25.31 32.65,25.31 33.41,24.55 33.41,24.42 34.94,22.9 34.94,16.42 32.94,14.43 v32.94,13.73
IMU_INT1  (via drill 0.3)
  Top 0.127: U1.P$N1 32.3,14.46 32.3,13.18 v32.58,12.89 | v25.57,15.12 26.5,16.05 26.5,20.12 27.07,20.7 v27.07,24.23 | v23.15,26.5 23.15,26.08 IC3.5
  Bottom 0.127: v25.57,15.12 30.35,15.12 v32.58,12.89 | v23.15,26.5 24.03,25.62 24.52,25.62 25.92,24.23 v27.07,24.23
IMU_INT2  (via drill 0.35)
  Route2 0.127: U1.P$P2 32.06,14.06 29.85,11.85 25.65,11.85 24.8,12.7 24.8,25.9 24.75,25.95 IC3.6
  other vias: 32.06,15.45 22.52,25.95
LX1
  Top 0.127: IC9.C1 12,31.88 12.25,31.88 IC9.C2 12.38,31.88 12.38,32.12 IC9.B2 | IC9.B1 12,32.25 12.25,32.25 IC9.B2 | IC9.B2 12.38,32.25 12.62,32.25 IC9.B3 12.75,32.25 12.88,32.25 13,32.38 13.88,32.38 L7.1
LX2
  Top 0.127: 12.75,31.5 12.38,31.5 IC9.D2 | 12.75,31.5 13.88,31.5 L7.2 | 12.75,31.5 IC9.D3
MOSI  (via drill 0.35)
  Top 0.127: v12,17.5 11.29,16.79 J1.14
  Bottom 0.127: U1.P$B13 27.5,18.2 25.45,18.2 24.25,17 12.5,17 v12,17.5
  other vias: 28.81,18.2
N$1
  Top 0.127: U1.P$B3 28.75,15.62 27.5,15.62 27.5,12.12 26.25,10.88 L2.1
N$2  (via drill 0.3)
  Top 0.127: v29.12,13 29.12,14.75 29.25,14.88 U1.P$C1 | v32.38,11.5 32.5,11.38 32.5,10.75 C5.1
  Bottom 0.127: v29.12,13 30.62,11.5 v32.38,11.5
N$3
  Top 0.127: L3.1 23.75,15.5 26.12,13.12 26.12,12 L2.2
N$4  (via drill 0.3)
  Top 0.127: v28,16.38 28,16.25 28.75,16.25 U1.P$B5 | v29.75,22 29.75,21.5 U1.P$E24 | C10.1 20.38,20.25 21.13,19.49 C16.1 22.49,20.29 22.94,20.29 22.94,19.53 22.87,19.47 v22.82,19.43 22.75,19.35 22.75,15.62 L3.2 22.62,15.5 22.62,15.38 20.38,15.38 C15.1
  Route15 0.127: v29.75,22 29.5,21.75 29.5,20.62 28.53,19.66 28.53,16.91 v28,16.38
  Bottom 0.127: v28,16.38 27.92,16.45 26.82,16.45 23.85,19.43 v22.82,19.43
N$5
  Top 0.127: C2-EP-DR.1 14.08,8.84 D4.2 15.25,8.88 15.25,9.38 14.75,9.88 16.62,11.75 D2.1
N$6  (via drill 0.3)
  Top 0.127: v27.38,19.47 28.27,19.47 U1.P$A18 | C13.1 27.76,25.06 27.95,25.06 27.95,22.34 v27.83,22.21
  Route2 0.127: v27.38,19.47 27.38,20.8 27.83,21.25 v27.83,22.21
N$7  (via drill 0.3)
  Top 0.127: v8.12,32.25 9,33.12 9.75,33.12 9.75,32.75 R4.1 | IC9.D1 11.89,31.47 v11.41,31.47
  Bottom 0.127: v8.12,32.25 9.82,32.25 9.84,32.27 10.6,32.27 v11.41,31.47
N$8  (via drill 0.3)
  Top 0.127: v38.38,20 38.88,20 C11.1 | v28.88,20.88 29.5,20.88 U1.P$D23
  Bottom 0.127: v38.38,20 34.62,20 34.38,20.25 34,20.25 33.62,20.62 33.5,20.62 33.25,20.88 v28.88,20.88
N$9  (via drill 0.3)
  Top 0.127: v30.88,26.12 30.25,26.75 IC2.A2 | v31.88,26.25 32.12,26.5 32.12,27.62 32.62,28.12 C32.1
  Route2 0.127: v30.88,26.12 31,26.25 v31.88,26.25
N$10  (via drill 0.3)
  Top 0.127: v12,30 12,30.88 11.88,31 IC9.E1 | v4.75,32.38 5.12,32.38 5.25,32.5 6.88,32.5 7.5,31.88 7.5,31.62 R2.1
  Bottom 0.127: v12,30 11.88,30.12 7.26,30.12 6.7,29.56 6.36,29.56 5.93,29.99 5.93,31.19 v4.75,32.38
N$11
  Top 0.127: R9.2 6.88,29.12 6.88,29.04 7.22,28.7 7.56,28.7 7.59,28.73 IC1.D1
N$12
  Top 0.127: J1.18 10.58,15.92 10.25,16.38 10.38,16.5 11.5,16.5 14.68,16.31 EPD_C6.2
N$13  (via drill 0.3)
  Top 0.127: v14.35,14.93 10.28,10.85 10.38,10.75 EPD_C7.2 | v12.28,14.2 10.66,14.2 J1.19
  Bottom 0.127: v12.28,14.2 13,14.93 v14.35,14.93
N$14
  Top 0.127: J1.20 9.12,13.36 9.12,8 9.38,7.75 EPD_C8.2
N$15
  Top 0.127: IC3.1 23.81,24.15 25.62,24.15 25.62,23.62 23.5,23.62 R3.1
N$16
  Top 0.127: Q3.3 17.12,16.03 15.38,14.5 D5.2 15.38,14.38 14,13 14,9.58 C2-EP-DR.2 13.25,9.16 13.25,8.38 10.75,5.88 L5.2
N$17
  Top 0.127: J4.A5 24.25,27.5 R1_USB.2
N$18
  Top 0.127: J4.A9_B4 20.62,28.38 20.88,28.62 20.88,29 21.62,29.75 25.25,29.75 25.25,28.5 25.38,28.38 J4.A4_B9
N$19  (via drill 0.3)
  Top 0.127: v29.75,9.25 29.38,9.62 29.38,10.5 X2.2 29.38,10.62 29.54,10.79 29.54,14.2 29.61,14.26 29.61,15.4 U1.P$D2 | C17.2 31.75,7.5 31.23,7.5 v31.12,7.4
  Route2 0.127: v29.75,9.25 30.58,8.42 30.58,8.01 31.12,7.46 v31.12,7.4
N$20  (via drill 0.3)
  Top 0.127: 30.5,9.38 30.5,9.25 29.38,8.12 X2.1 | 30.5,9.38 30.5,11.12 29.94,11.68 29.94,15.32 U1.P$F2 | v36.12,8.5 36.12,10.5 C18.2 | 30.5,9.38 31.12,8.75 v31.12,8.23
  Bottom 0.127: v36.12,8.5 31.39,8.5 v31.12,8.23
N$21
  Top 0.127: J1.22 8.62,13.36 8.62,1.38 8,0.75 5.5,0.75 5.5,8.5 EPD_C10.2
N$22  (via drill 0.3)
  Top 0.127: v34.38,14.88 34.38,16.12 U1.P$AC5 | v38,15.12 38.12,15.25 38.12,16 38,16.12 37.75,16.12 C20.1
  Bottom 0.127: v34.38,14.88 34.62,15.12 v38,15.12
N$23  (via drill 0.3)
  Top 0.127: v28.25,31.25 28.25,21 U1.P$A23 | v40.75,28.12 42.38,26.5 42.38,21.88 | 42.38,21.88 42.38,21.75 X1.3 42.38,21.88 | 42.38,21.88 43.62,21.88 C2.1
  Bottom 0.127: v28.25,31.25 28.5,31 35.25,31 36.75,29.5 38.38,29.5 39.75,28.12 v40.75,28.12
N$25
  Top 0.127: J4.B5 R2_USB.1
N$26
  Top 0.127: J1.24 7.38,11.89 7.38,5.38 7,5 7,2.12 6.5,1.62 EPD_C12.2
N$27  (via drill 0.3)
  Top 0.127: v30.5,23.38 29.25,22.12 29.25,21.88 28.88,21.5 U1.P$B24 | 39.5,22 40.88,20.62 X1.1 | 39.5,22 39.5,21.12 39.12,21.12 C1.1 | 39.5,22 v39.38,22.12
  Bottom 0.127: v30.5,23.38 38.12,23.38 v39.38,22.12
N$28
  Top 0.127: L1.2 40,18.38 40,17.62 41.12,17.62 C4.1 41.25,17.62 43.12,17.62 43.12,18 ANT1.1 43.25,18.12 43.25,19.88 43.62,20.25 C22.1
N$29  (via drill 0.3)
  Top 0.127: v32.62,22.38 32.62,22.25 32,21.62 32,21.5 31.88,21.5 U1.P$N24 | v37.5,20.62 37.5,17.62 39.25,15.88 39.25,15.5 C9.1
  Bottom 0.127: v32.62,22.38 34.38,20.62 v37.5,20.62
N$30  (via drill 0.3)
  Top 0.127: v31.38,22.88 31,22.88 30.38,22.25 30.38,21.12 30.5,21 U1.P$H23 | v37.62,22.88 38,22.5 38,20.25 37.88,20.12 37.88,19.5 38.88,18.5 L1.1 39,18.38 39,17.12 39.12,17 C3.1
  Bottom 0.127: v37.62,22.88 v31.38,22.88
N$31
  Top 0.127: J1.5 11.05,21.43 12.45,21.02 EPD_C1.2
N$32  (via drill 0.3)
  Top 0.127: v11.97,22.1 10.89,22.1 J1.4 | EPD_C2.2 15.54,20.79 15.5,20.75 15,20.75 v15,20.98
  Bottom 0.127: v11.97,22.1 13.1,20.98 v15,20.98
N$35  (via drill 0.3)
  Top 0.127: R_TYPE_SEL.2 8.12,26.75 8.12,26.38 8.88,25.62 R1_EP_DR.1 9,25.5 9.65,25.5 v9.65,26.75 | v13.12,25.12 13.25,25.25 14.4,25.25 SJ1.2
  Bottom 0.127: v13.12,25.12 11.28,25.12 v9.65,26.75
OUT+
  Top 0.127: IC2.A3 29.73,26.2 30.05,25.88 30.05,24.98 TP_OP.TP
OUT-
  Top 0.127: IC2.C3 29.75,27.88 29.75,30.5 TP_ON.TP
P0.13  (via drill 0.3)
  Top 0.127: v35.88,11.62 36.12,11.88 36.12,16.38 35.75,16.75 35.75,16.88 34.88,16.88 U1.P$AD8 | 21.75,5.12 20.12,5.12 C30.1 | 21.75,5.12 21.75,5.25 R5.1 21.88,5.38 21.88,7.12 v20.75,8.25 | 21.75,5.12 21.75,4 SW_UP.2
  Bottom 0.127: v35.88,11.62 33.02,8.78 21.28,8.78 v20.75,8.25
P0.14  (via drill 0.3)
  Top 0.127: R8.1 10.12,3.5 10.62,4 SW_ENT.2 10.75,4 11.12,4.38 11.12,5.88 13.62,5.88 C31.1 13.73,5.94 13.73,6.64 13.79,6.71 15.44,6.71 17.35,8.61 17.35,8.99 18.05,9.69 v19.06,9.69 | v34.37,16.67 34.37,17.18 U1.P$AC9
  Route15 0.127: v19.06,9.69 19.86,8.89 26.44,8.89 26.64,8.69 27.66,8.69 31.57,12.6 31.57,13.6 34.37,16.4 v34.37,16.67
P1.01  (via drill 0.3)
  Top 0.127: Q1.1 25.38,11.5 25.38,8.38 26,7.75 R_PWR_EPD.1 26.11,7.72 26.11,8.8 26.24,8.93 26.24,9.88 28.14,11.79 28.14,14.07 v27.95,14.26 | v32.84,24.3 32.84,24.04 34.62,22.26 34.62,21.31 34.24,20.93 33.6,20.93 U1.P$Y23
  Route15 0.127: v32.84,24.3 31.64,24.3 31.26,24.68 30.75,24.68 28.4,22.33 28.4,21.18 28.27,21.06 28.27,18.44 28.28,18.43 28.28,17.44 27.45,16.61 27.45,14.77 v27.95,14.26
P1.02  (via drill 0.3)
  Top 0.127: SW_DN.2 32.75,4 32.75,4.62 R7.1 32.75,4.75 33.75,5.75 33.75,6.62 C29.1 33.88,6.75 35,6.75 36.62,8.38 36.62,10.75 36.5,10.88 36.5,14.38 37.12,15 37.12,18.38 37,18.5 37,20.75 37.12,20.88 37.12,23.5 v36.25,24.38 | v31,24.12 31,23.75 31.88,23.75 33.12,22.5 33.12,21.62 33.25,21.5 U1.P$W24
  Bottom 0.127: v31,24.12 31.62,24.75 35.88,24.75 v36.25,24.38
PMIC_INT  (via drill 0.35)
  Route2 0.127: U1.P$T2 32.56,14.24 32.6,14.2 32.6,14 30.05,11.45 25.35,11.45 17.1,19.7 v17.1,24.7 | v14.57,26.93 9.47,26.93 8.55,27.85 IC1.A1
  Route15 0.127: v17.1,24.7 16.85,24.7 14.6,26.95 v14.57,26.93
  other vias: 32.56,15.45 8.56,29.93
PREVGH  (via drill 0.3)
  Top 0.127: v17.75,14 18.88,14 18.88,14.38 D5.1 | v12.32,12.2 11.66,12.2 J1.21 | v3.38,7.12 2.62,7.12 EPD_C9.2
  Bottom 0.127: v17.75,14 15.95,12.2 v12.32,12.2 12.32,15.32 7.25,10.25 6.5,10.25 v3.38,7.12
PREVGL  (via drill 0.3)
  Top 0.127: 8.25,10.25 8.25,5.12 7.75,4.62 EPD_C11.2 7.75,4.5 7.75,1.62 EPD_C12.1 | 8.25,10.25 8.25,12.97 J1.23 | EPD_C11.1 6.5,4.62 6.62,4.75 6.62,8.5 EPD_C10.1 6.62,8.62 6.62,9.25 | 6.62,9.25 5,9.25 4.75,9 4.75,5.88 2.62,5.88 EPD_C9.1 | EPD_C8.1 10.75,7.75 11.62,8.62 11.62,10.62 EPD_C7.1 11.75,10.75 11.75,11.88 11.87,11.88 12.27,12.28 v14.85,12.28 19.98,12.28 EPD_C6.1 | v19.12,11.88 20.12,11.88 D2.2 | v6.75,9.38 6.62,9.25 | v8.12,10.25 8.25,10.25 | v15.38,19.12 15.38,16.5 EPD_C5.1
  Route15 0.127: v15.38,19.12 15,18.75 15,12.5 14.88,12.38 v14.85,12.28
  Bottom 0.127: v19.12,11.88 18.73,12.28 v14.85,12.28 9.65,12.28 7.88,10.5 | 7.88,10.5 v6.75,9.38 | 7.88,10.5 v8.12,10.25
RESE  (via drill 0.3)
  Top 0.127: 8.88,25 8.88,26.77 v13.18,22.48 | 8.88,25 R1_EP_DR.2 | J1.3 10.58,23.3 8.88,25 | v18.95,17.57 16.75,19.77 16.75,20.12 16.5,19.88 16.79,18.19 Q3.2
  Bottom 0.127: v18.95,17.57 14.05,22.48 v13.18,22.48
RESET  (via drill 0.35)
  Top 0.127: v43,8 43,9.7 TP_RESET.TP | v36.6,27.25 36.11,27.74 J2.6
  Route2 0.127: U1.P$AC13 35.05,17.46 35.05,7.9 35.7,7.25 41.85,7.25 | 41.85,7.25 42.9,7.25 43,7.35 v43,8 | 41.85,7.25 41.85,24.75 39.75,26.85 37,26.85 v36.6,27.25
  other vias: 34.31,18.2 34.31,18.2
SCK  (via drill 0.3)
  Top 0.127: U1.P$A12 27.52,17.15 27.1,17.15 v27.1,17.12 | J1.13 12.44,17.29 v13.61,18.46
  Bottom 0.127: v13.61,18.46 20.91,18.46 22.6,20.15 24.08,20.15 v27.1,17.12
SCL  (via drill 0.3, 0.35)
  Top 0.127: IC1.B1 8.5,29.5 8.25,29.75 v8.25,30.75 8.25,31.75 9.25,32.75 R4.2 | v30.75,29.25 30.75,27.75 IC2.C1 | v22.75,23.75 22.75,24 23,24.25 IC3.12 | v37.25,24.25 37.25,25 36,25 35.25,25.75 35.25,27.25 34.5,27.25 34.25,27 34.25,24 34.5,23.75 R17.2 | v6.5,31.5 5.75,31.5 U3.7 | v37.75,6.5 37.75,5.75 36.75,5.75 TP_SCL.TP | v33.2,11.75 31.6,13.35 v30.9,13.35
  Route2 0.127: R17.2 35,23.15 35,22.55 35.5,22.05 36.5,22.05 37.9,20.65 37.9,12.2 38.95,12.2 38.95,11.6 38.85,11.5 v38.6,11.5 | v30.9,13.35 31.55,14 U1.P$M2
  Bottom 0.127: v30.75,29.25 29.5,30.5 26.75,30.5 | 26.75,30.5 17.5,30.5 17.25,30.75 12,30.75 | 12,30.75 v8.25,30.75 7.25,30.75 v6.5,31.5 | v22.75,23.75 19.75,26.75 16,26.75 12,30.75 | v37.25,24.25 37.5,24.5 40,24.5 | 40,24.5 41.5,26 41.5,33.25 29.5,33.25 26.75,30.5 | v37.75,6.5 45.5,14.25 45.5,24.5 40,24.5 | v38.6,11.5 36.95,11.5 35.95,12.5 34.6,11.15 33.55,11.15 33.2,11.5 v33.2,11.75
  other vias: 34.39,23.77 31.56,15.45
SDA  (via drill 0.3, 0.35)
  Top 0.127: v25.5,25.55 25.5,25.15 25.27,24.92 IC3.2 23.03,24.92 22.9,25.05 v22.65,25.05 | R18.2 16.15,28.6 16.1,28.6 16.1,27.65 16.5,27.25 16.5,26.5 18.54,24.46 18.54,23.19 | v19.2,23.85 18.54,23.19 | 18.54,23.19 TP_SDA.TP 18.55,22.33 19.25,22.33 19.32,22.26 19.32,21.31 19.57,21.06 19.57,16.55 v18.17,15.15 | 7.41,29.28 7.25,29.44 7.25,30.2 7.06,30.39 7.06,31.47 R2.2 7.06,31.53 7.06,31.91 6.93,32.04 5.6,32.04 U3.8 | 7.41,29.28 7.57,29.12 8.52,29.12 IC1.C1 | v30.37,14.08 30.76,14.08 31.26,14.58 31.26,14.9 U1.P$L1 | v7.57,29.44 7.41,29.28
  Route2 0.127: v22.65,25.05 19.95,25.05 19.15,24.25 19.15,23.9 v19.2,23.85
  Bottom 0.127: IC2.B2 29.03,26.1 25.5,26.1 v25.5,25.55 | v30.37,14.08 29.61,14.83 25.92,14.83 25.79,14.71 18.62,14.71 v18.17,15.15 | v7.57,29.44 7.95,29.82 9.35,29.82 12.14,27.02 12.52,27.02 16.4,23.15 18.49,23.15 v19.19,23.85 v19.2,23.85
  other vias: 30.23,27.3
SWDCLK  (via drill 0.3)
  Top 0.127: v33.62,22.25 33.62,21.62 33.75,21.5 U1.P$AA24 | TP_SWDCLK.TP 44.5,12.12 v44.5,14.88 44.62,15 44.62,30.12 39.25,30.12 39,30.38 38.38,30.38 38,30 38,29.5 37.62,29.12 37.62,28.62 37.5,28.5 J2.4
  Bottom 0.127: v33.62,22.25 33.75,22.38 37,22.38 v44.5,14.88
SWDIO  (via drill 0.3)
  Top 0.127: v32.75,25.88 32.38,25.5 32.38,24.12 34.12,22.38 34.12,21.62 34.25,21.5 U1.P$AC24 | v37.75,25 38.38,25.62 38.38,28.12 38.62,28.38 J2.2 38.75,28.38 38.75,28.25 40.25,28.25 40.75,28.75 40.75,28.88 43.25,28.88 TP_SWDIO.TP
  Bottom 0.127: v32.75,25.88 33.5,25.12 36.25,25.12 36.38,25 v37.75,25
SWO  (via drill 0.3)
  Top 0.127: v34.75,26.75 34.75,24.88 35.38,24.25 35.38,20.5 34.88,20.5 U1.P$AD22 | v38.62,25.25 39.5,24.38 39.5,23.62 TP_SWO.TP
  Bottom 0.127: v34.75,26.75 36.12,28.12 37.38,28.12 38.38,27.12 38.38,25.25 v38.62,25.25
VBAT  (via drill 0.3)
  Top 0.3: 9.47,29.12 9.75,29.12 10.38,28.5 10.38,26 10.5,25.88 C37.1 | 9.47,29.12 9,29.12 IC1.C2 | 3.12,31.5 2.12,30.5 C27.1 | 3.5,31.5 3.12,31.5 | 3.5,31.5 U3.2 | 3.5,31.5 3.5,31.12 U3.3 | 3.47,32.84 4.25,33.62 7.12,33.62 TP_VBAT.TP | 3.47,32.84 2.88,32.25 2.88,31.88 3.12,31.62 3.12,31.5 | 9.47,29.12 9.47,28.8 9.54,28.74 v9.54,28.69 | 3.47,32.84 v3.76,32.55
  Bottom 0.3: v3.76,32.55 4.46,31.85 4.78,31.85 5.54,31.09 5.54,29.88 6.81,28.61 7.63,28.61 7.89,28.87 9.37,28.87 v9.54,28.69
VBUS  (via drill 0.3)
  Top 0.3: v12.75,28.75 13.5,28.75 C38.1 | IC1.A2 9,30 9,30.25 | v34.62,13.07 35,13.45 35,15.25 34.88,15.38 U1.P$AD2 | D3.5 39.75,10.12 39.75,12.75 39.38,13.12 C43.1 39.25,13.38 39.25,13.62 v38.75,14.12 | 9,30.25 9,30.75 8.75,31 8.75,31.12 C42.1 | v10.95,28.82 10.88,29 10.88,29.75 C21.1 10.88,29.88 10.88,30.25 9,30.25
  Route2 0.3: v12.75,28.75 13.25,29.25 17.75,29.25 18.62,30.12 27.62,30.12 30.25,27.5 32.88,27.5 35.5,24.88 35.5,22.62 36.88,22.62 39.12,20.38 39.12,14.12 v38.75,14.12
  Bottom 0.3: v12.75,28.75 12.66,28.66 12.46,28.87 11.06,28.87 11.02,28.82 v10.95,28.82 | v34.62,13.07 35.17,13.62 38.12,13.62 38.62,14.12 v38.75,14.12
VREG  (via drill 0.35)
  Top 0.3: C24.2 11.55,34.1 v11.55,33 IC9.A1 12.08,32.68 12.14,32.61 12.21,32.68 12.27,32.68 IC9.A2 12.46,32.68 12.52,32.61 12.59,32.68 IC9.A3 13.61,33.51 C39.1 | C23.1 15.34,33.97 C39.1 | C39.1 15.34,32.2 TP_VREG.TP | IC1.B2 8.98,29.55 10.25,29.55 v10.25,29.7
  Route2 0.3: v10.25,29.7 10.25,31.2 11.55,32.5 v11.55,33